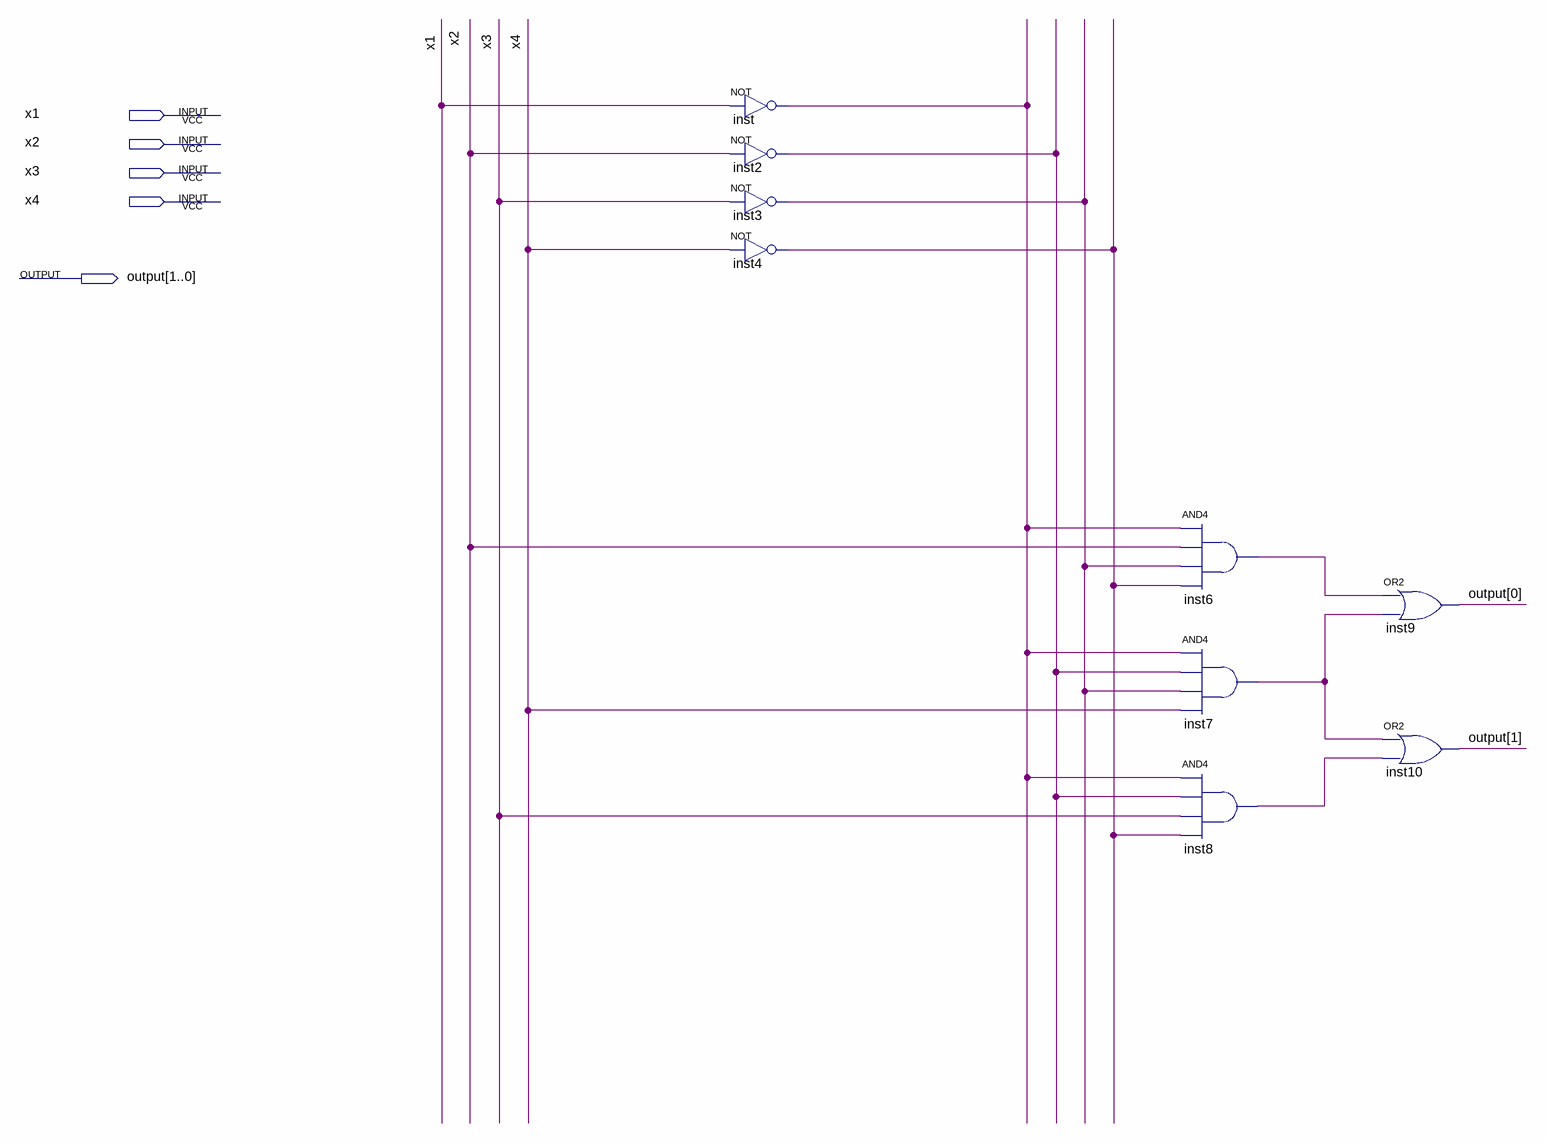
[diagram p0: schematic sheet]
// Quartus schematic Encoder.bdf as structural Verilog: 9 symbols, 5 pins
module Encoder (
  input  x1,
  input  x2,
  input  x3,
  input  x4,
  output [1:0] \output 
);

  wire inst2_out, inst3_out, inst4_out, inst6_out, inst7_out, inst8_out, inst_out;

  not inst (inst_out, x1);
  not inst2 (inst2_out, x2);
  not inst3 (inst3_out, x3);
  not inst4 (inst4_out, x4);
  and inst6 (inst6_out, inst_out, x2, inst3_out, inst4_out);
  and inst7 (inst7_out, inst_out, inst2_out, inst3_out, x4);
  and inst8 (inst8_out, inst_out, inst2_out, x3, inst4_out);
  or inst9 (\output [0], inst6_out, inst7_out);
  or inst10 (\output [1], inst7_out, inst8_out);
endmodule
